# EAGLE design tlc5971-v3 (EAGLE 7.7.0)
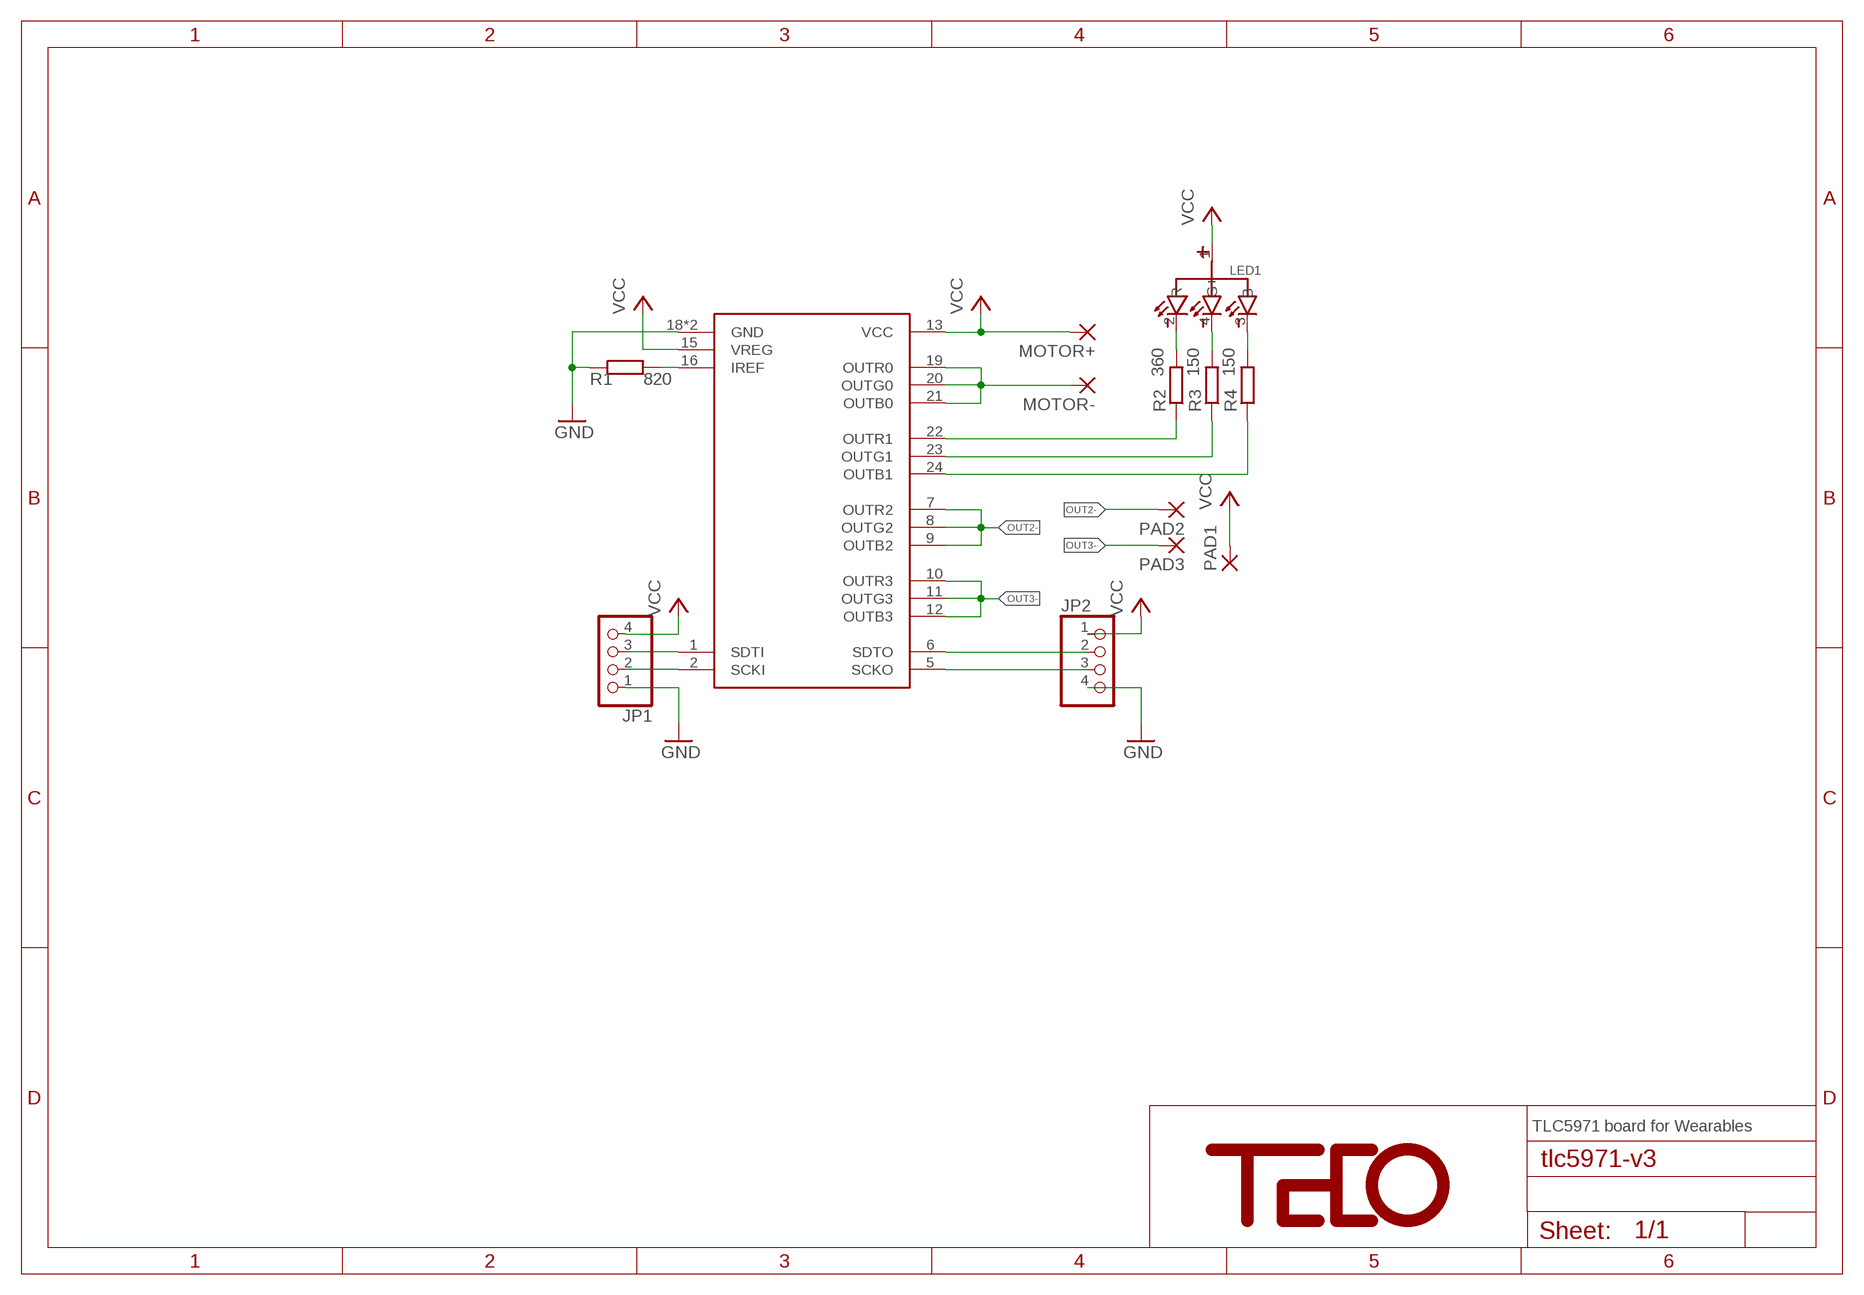
[diagram p0: schematic, sheet 1]

## Parts
JP1  PINHD-1X4  [1X04]
JP2  PINHD-1X4  [1X04]
LED1  SML-LX0404SIUPGUSB  [SML_LED]
MOTOR+  SMD2  [SMD1,27-2,54]
MOTOR-  SMD2  [SMD1,27-2,54]
PAD1  SMD2  [SMD1,27-2,54]
PAD2  SMD2  [SMD1,27-2,54]
PAD3  SMD2  [SMD1,27-2,54]
R1  820  R-EU_R0402  [R0402]
R2  360  R-EU_R0402  [R0402]
R3  150  R-EU_R0402  [R0402]
R4  150  R-EU_R0402  [R0402]
U$1  TLC5971  [RGE.24]
U$3  TECO-LOGO-BIG  [TECO-LOGO-BIG]

## Nets
GND: JP1.1 JP2.4 R1.1 U$1.18(GND) U$1.PAD(GND)
N$1: LED1.2(R) R2.2
N$3: R1.2 U$1.16(IREF)
N$4: JP1.3 U$1.1(SDTI)
N$5: JP1.2 U$1.2(SCKI)
N$6: JP2.2 U$1.6(SDTO)
N$7: JP2.3 U$1.5(SCKO)
N$8: LED1.4(G) R3.2
N$9: LED1.3(B) R4.2
N$11: R2.1 U$1.22(OUTR1)
N$12: R3.1 U$1.23(OUTG1)
N$13: R4.1 U$1.24(OUTB1)
OUT0-: MOTOR-.1(P) U$1.19(OUTR0) U$1.20(OUTG0) U$1.21(OUTB0)
OUT2-: PAD2.1(P) U$1.7(OUTR2) U$1.8(OUTG2) U$1.9(OUTB2)
OUT3-: PAD3.1(P) U$1.10(OUTR3) U$1.11(OUTG3) U$1.12(OUTB3)
VCC: JP1.4 JP2.1 LED1.1(+) MOTOR+.1(P) PAD1.1(P) U$1.13(VCC) U$1.15(VREG)

## Notes on the sheet
- TLC5971 board for Wearables

## Library data of the parts
JP1 JP2 = pinhead:PINHD-1X4: PIN HEADER
LED1 = bluepart:SML-LX0404SIUPGUSB
MOTOR+ MOTOR- PAD1-PAD3 = wirepad:SMD2: SMD PAD
R1-R4 = rcl:R-EU_: RESISTOR, European symbol
U$1 = ti-packages:TLC5971
U$3 = teco_div:TECO-LOGO-BIG

## Board
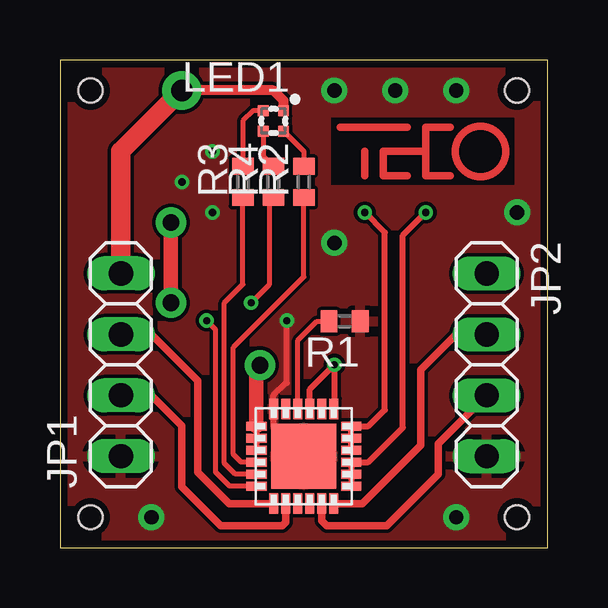
[diagram p1: board, top side]
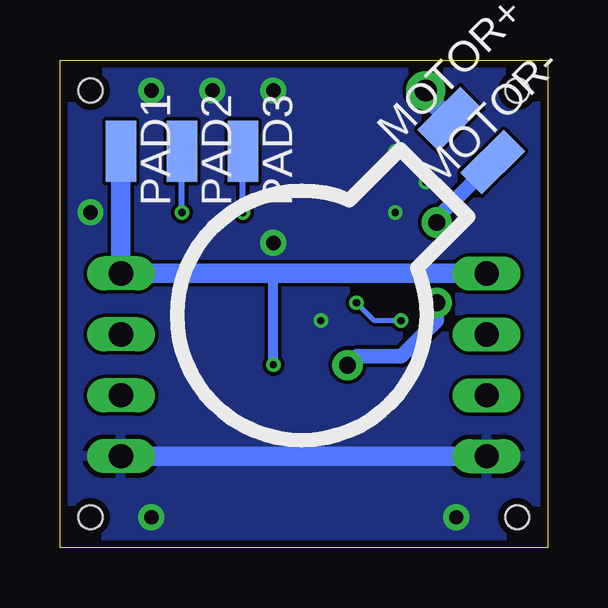
[diagram p2: board, bottom side, seen from below]

Size 20.32 x 20.32 mm. Coordinates in mm from the lower left corner, seen from the top.
Outline: 0,0 20.32,0 20.32,20.32 0,20.32 0,0
Copper layers (1*16): Top 0.035mm / dielectric 1.5mm / Bottom 0.035mm
Design rules "PCB-POOL Standard": minimum track width 0.15mm, minimum drill 0.3mm, track to track 0.15mm, track to pad 0.15mm, pad to pad 0.15mm, via to via 0.15mm, smd to smd 0.15mm, copper to edge 0.3mm, drill to drill 0.2mm, minimum pad ring 0.2mm, minimum via ring 0.15mm, stop-mask expansion 0.075mm, vias tented up to drill 0mil, thermal gap 0.2mm
Holes 1 mm at 1.27,1.27 19.05,1.27 19.05,19.05 1.27,19.05

### Footprints (pad centres in the part's own frame; a part is rotated, then mirrored left to right if it is on the bottom)
1X04 = drill 1.016 long: 1 -3.81,0; 2 -1.27,0; 3 1.27,0; 4 3.81,0
SML_LED = smd 0.45 x 0.45: 1 0.425,0.425; 2 0.425,-0.425; 3 -0.425,-0.425; 4 -0.425,0.425
SMD1,27-2,54 = smd 1.27 x 2.54: 1 0,0
R0402 = smd 0.7 x 0.9: 1 -0.65,0; 2 0.65,0
RGE.24 = smd 0.85 x 0.38: 1 -1.975,1.25; 2 -1.975,0.75; 3 -1.975,0.25; 4 -1.975,-0.25; 5 -1.975,-0.75; 6 -1.975,-1.25; 13 1.975,-1.25; 14 1.975,-0.75; 15 1.975,-0.25; 16 1.975,0.25; 17 1.975,0.75; 18 1.975,1.25 | smd 0.38 x 0.85: 7 -1.25,-1.975; 8 -0.75,-1.975; 9 -0.25,-1.975; 10 0.25,-1.975; 11 0.75,-1.975; 12 1.25,-1.975; 19 1.25,1.975; 20 0.75,1.975; 21 0.25,1.975; 22 -0.25,1.975; 23 -0.75,1.975; 24 -1.25,1.975 | smd 2.7 x 2.7: PAD 0,0

### Placement (x,y rotation side)
JP1  2.54,7.62 90 top
JP2  17.78,7.62 270 top
LED1  8.89,17.78 0 top
MOTOR+  4.09,17.86 315 bottom
MOTOR-  2.29,16.06 315 bottom
PAD1  17.78,16.51 180 bottom
PAD2  15.24,16.51 180 bottom
PAD3  12.7,16.51 180 bottom
R1  11.85,9.43 180 top
R2  10.16,15.24 90 top
R3  7.62,15.24 90 top
R4  8.89,15.24 90 top
U$1  10.16,3.81 90 top
U$3  15.24,16.51 0 top

### Tracks (layer width: path | path; a pad name or v marks a point on that pad's centre or on a via)
GND  (via drill 0.3, 0.6)
  Top 0.2: U$1.18 8.91,3.83 8.89,3.81 U$1.PAD
  Top 0.254: U$1.18 8.89,5.8 | 8.89,5.8 8.89,6.35 9.4,6.86 9.45,6.86 v9.45,9.46 | 8.89,5.8 8.89,5.08 U$1.PAD
  Bottom 0.813: JP1.1 JP2.4
  other vias: 5.08,15.24 6.35,16.51 6.35,13.97 3.81,1.27 16.51,1.27 16.51,19.05 13.97,19.05 11.43,19.05 11.43,12.7 19.05,13.97
  pour Bottom: 0,0 20.32,0 20.32,20.32 0,20.32
  pour Top: 0,0 20.32,0 20.32,20.32 0,20.32
N$1
  Top 0.2: LED1.2 10.16,16.51 R2.2
N$3
  Top 0.2: U$1.16 9.91,8.64 10.7,9.43 R1.2
N$4
  Top 0.305: JP1.3 3.81,8.89 5.74,6.96 5.74,3.14 7.05,1.84 U$1.1
N$5
  Top 0.305: JP1.2 3.81,6.35 5.08,5.08 5.08,2.54 6.7,0.92 9.27,0.92 9.41,1.06 U$1.2
N$6
  Top 0.305: JP2.2 16.51,8.89 15.02,7.41 15.02,4.26 12.6,1.84 U$1.6
N$7
  Top 0.305: JP2.3 15.77,4.34 15.77,3.07 13.62,0.92 11.12,0.92 10.91,1.13 U$1.5
N$8
  Top 0.2: LED1.4 8.05,18.2 7.62,17.78 R3.2
N$9
  Top 0.2: LED1.3 8.46,16.31 R4.2
N$11
  Top 0.2: U$1.22 7.55,3.56 7.22,3.89 7.22,8.35 10.16,11.28 R2.1
N$12
  Top 0.2: U$1.23 7.31,3.06 6.85,3.52 6.85,10.2 7.62,10.97 R3.1
N$13  (via drill 0.3)
  Top 0.2: U$1.24 7.06,2.56 6.48,3.14 6.48,9.09 v6.11,9.46 | R4.1 8.71,14.41 8.71,10.95 v7.97,10.2
  Bottom 0.2: v6.11,9.46 7.22,9.46 v7.97,10.2
OUT0-  (via drill 0.7)
  Top 0.254: U$1.21 U$1.20 U$1.19
  Top 0.61: v4.62,13.55 v4.62,10.2 | v8.34,7.6 8.18,7.45 U$1.19
  Bottom 0.61: MOTOR-.1 4.62,13.73 v4.62,13.55 | v4.62,10.2 4.62,9.46 6.11,7.97 7.97,7.97 v8.34,7.6
OUT2-  (via drill 0.3)
  Top 0.254: U$1.7 U$1.8 U$1.9 12.84,3.56 14.28,5 14.28,13.01 v15.24,13.97
  Bottom 0.254: v15.24,13.97 PAD2.1
OUT3-  (via drill 0.3)
  Top 0.254: U$1.10 U$1.11 U$1.12 12.85,5.06 13.54,5.75 13.54,13.13 v12.7,13.97
  Bottom 0.254: v12.7,13.97 PAD3.1
VCC  (via drill 0.3, 0.9)
  Top 0.254: U$1.13 11.43,5.8 v11.43,7.62 10.41,6.6 U$1.15
  Top 0.406: LED1.1 9.31,18.62 8.89,19.05 v5.08,19.05
  Top 0.813: JP1.4 2.54,16.51 v5.08,19.05
  Bottom 0.406: v11.43,7.62 11.43,11.43
  Bottom 0.813: JP1.4 11.43,11.43 JP2.1 PAD1.1 | v5.08,19.05 5.08,18.85 MOTOR+.1